# Altium schematic sheet Top.SchDoc
size A4; Author: ALTIUM GOSTBOM2.0 KEV; SheetNumber: 1; SheetTotal: 7
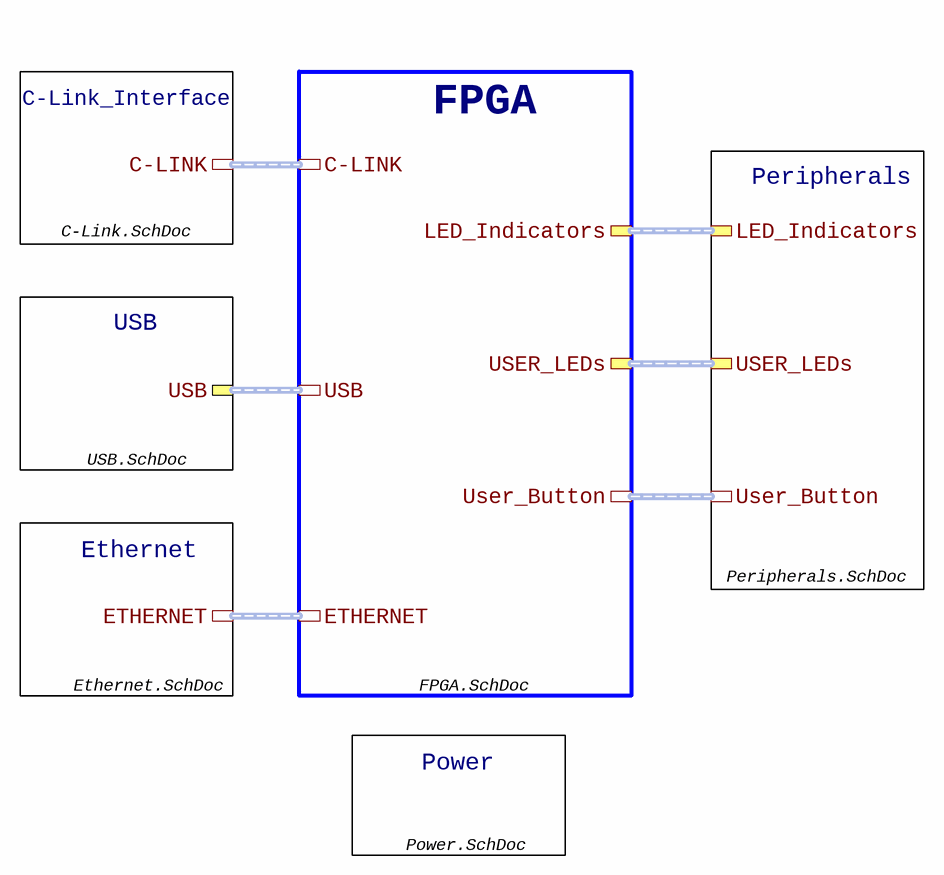
[diagram p0: Top.SchDoc]

## Sub-sheets
C-Link_Interface = C-Link.SchDoc: C-LINK (harness C-LINK)
Ethernet = Ethernet.SchDoc: ETHERNET (harness MII Signal Descriptions)
FPGA = FPGA.SchDoc: C-LINK (harness C-LINK), USB (harness USB), ETHERNET (harness MII Signal Descriptions), LED_Indicators (harness Indicators), USER_LEDs (harness USER_LEDs), User_Button (harness User_Button)
Peripherals = Peripherals.SchDoc: USER_LEDs (harness USER_LEDs), LED_Indicators (harness Indicators), User_Button (harness User_Button)  | NameFunctionGroup: Функциональная группа
Power = Power.SchDoc: no entries
USB = USB.SchDoc: USB (harness USB)

## Buses and harness runs
harness sheet C-Link_Interface/C-LINK = sheet FPGA/C-LINK
harness sheet Ethernet/ETHERNET = sheet FPGA/ETHERNET
harness sheet FPGA/LED_Indicators = sheet Peripherals/LED_Indicators
harness sheet FPGA/USB = sheet USB/USB
harness sheet FPGA/User_Button = sheet Peripherals/User_Button
harness sheet FPGA/USER_LEDs = sheet Peripherals/USER_LEDs

## Notes on the sheet
- Перв. примен.
- Справ. №
- Подп. дата
- Инв. № дубл.
- Взам. инв. №
- Подп. и дата
- Изм.
- Разраб.
- Лист
- № докум.
- Подп.
- Дата
- Лит.
- Масса
- Масштаб
- Пров.
- Т.контр.
- Листов
- Инв. № подл.
- Н.контр.
- Утв.
- ALTIUM GOSTBOM2.0 KEV
- Файл:
- Копировал
- Формат А3